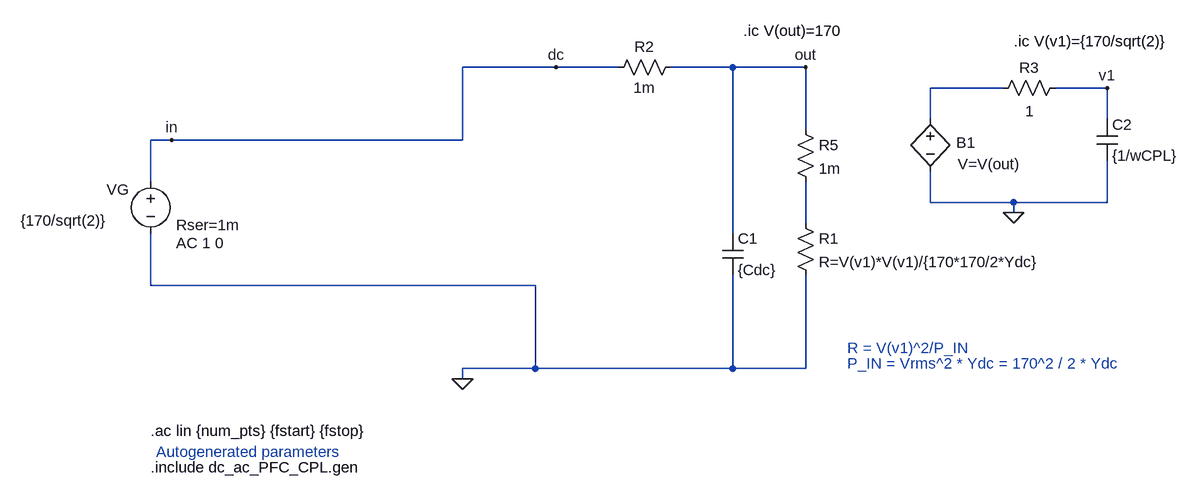
[diagram p0: schematic dc_ac_PFC_CPL.asc]
dc_ac_PFC_CPL.asc, the LTspice schematic file:
Version 4
SHEET 1 2640 776
WIRE 544 -480 400 -480
WIRE 640 -480 544 -480
WIRE 816 -480 720 -480
WIRE 928 -480 816 -480
WIRE 1232 -448 1120 -448
WIRE 1392 -448 1312 -448
WIRE 1120 -400 1120 -448
WIRE 1392 -400 1392 -448
WIRE 928 -384 928 -480
WIRE -48 -368 -80 -368
WIRE 400 -368 400 -480
WIRE 400 -368 -48 -368
WIRE -80 -304 -80 -368
WIRE 1120 -272 1120 -320
WIRE 1248 -272 1120 -272
WIRE 1392 -272 1392 -336
WIRE 1392 -272 1248 -272
WIRE 1248 -256 1248 -272
WIRE 928 -240 928 -304
WIRE 816 -224 816 -480
WIRE -80 -144 -80 -224
WIRE 512 -144 -80 -144
WIRE 512 -16 512 -144
WIRE 512 -16 400 -16
WIRE 816 -16 816 -160
WIRE 816 -16 512 -16
WIRE 928 -16 928 -160
WIRE 928 -16 816 -16
WIRE 400 0 400 -16
FLAG 400 0 0
FLAG 544 -480 dc
FLAG 928 -480 out
FLAG -48 -368 in
FLAG 1248 -256 0
FLAG 1392 -448 v1
SYMBOL voltage -80 -320 R0
WINDOW 123 39 111 Left 2
WINDOW 39 39 83 Left 2
WINDOW 3 -200 76 Left 2
WINDOW 0 -68 28 Left 2
SYMATTR Value2 AC 1 0
SYMATTR SpiceLine Rser=1m
SYMATTR Value {170/sqrt(2)}
SYMATTR InstName VG
SYMBOL cap 800 -224 R0
SYMATTR InstName C1
SYMATTR Value {Cdc}
SYMATTR SpiceLine Rser=1m
SYMBOL res 912 -256 R0
SYMATTR InstName R1
SYMATTR Value R=V(v1)*V(v1)/{170*170/2*Ydc}
SYMBOL res 624 -464 R270
WINDOW 0 32 56 VTop 2
WINDOW 3 0 56 VBottom 2
SYMATTR InstName R2
SYMATTR Value 1m
SYMBOL bv 1120 -416 R0
WINDOW 0 40 52 Left 2
WINDOW 3 42 85 Left 2
SYMATTR InstName B1
SYMATTR Value V=V(out)
SYMBOL cap 1376 -400 R0
SYMATTR InstName C2
SYMATTR Value {1/wCPL}
SYMATTR SpiceLine Rser=1u
SYMBOL res 1328 -464 R90
WINDOW 0 0 56 VBottom 2
WINDOW 3 36 55 VTop 2
SYMATTR InstName R3
SYMATTR Value 1
SYMBOL res 912 -400 R0
SYMATTR InstName R5
SYMATTR Value 1m
TEXT -80 136 Left 2 !.include dc_ac_PFC_CPL.gen
TEXT -72 112 Left 2 ;Autogenerated parameters
TEXT -80 80 Left 2 !.ac lin {num_pts} {fstart} {fstop}
TEXT 1248 -520 Left 2 !.ic V(v1)={170/sqrt(2)}
TEXT 992 -24 Left 2 ;P_IN = Vrms^2 * Ydc = 170^2 / 2 * Ydc
TEXT 992 -48 Left 2 ;R = V(v1)^2/P_IN
TEXT 832 -536 Left 2 !.ic V(out)=170

The netlist it stands for:
* dc_ac_PFC_CPL.asc
VG in 0 {170/sqrt(2)} AC 1 0 Rser=1m
C1 out 0 {Cdc} Rser=1m
R1 N002 0 R=V(v1)*V(v1)/{170*170/2*Ydc}
R2 in out 1m
B1 N001 0 V=V(out)
C2 v1 0 {1/wCPL} Rser=1u
R3 v1 N001 1
R5 out N002 1m
.include dc_ac_PFC_CPL.gen
* Autogenerated parameters
.ac lin {num_pts} {fstart} {fstop}
.ic V(v1)={170/sqrt(2)}
* P_IN = Vrms^2 * Ydc = 170^2 / 2 * Ydc
* R = V(v1)^2/P_IN
.ic V(out)=170
.backanno
.end